# EAGLE design AS5600_Module (EAGLE 9.6.2)
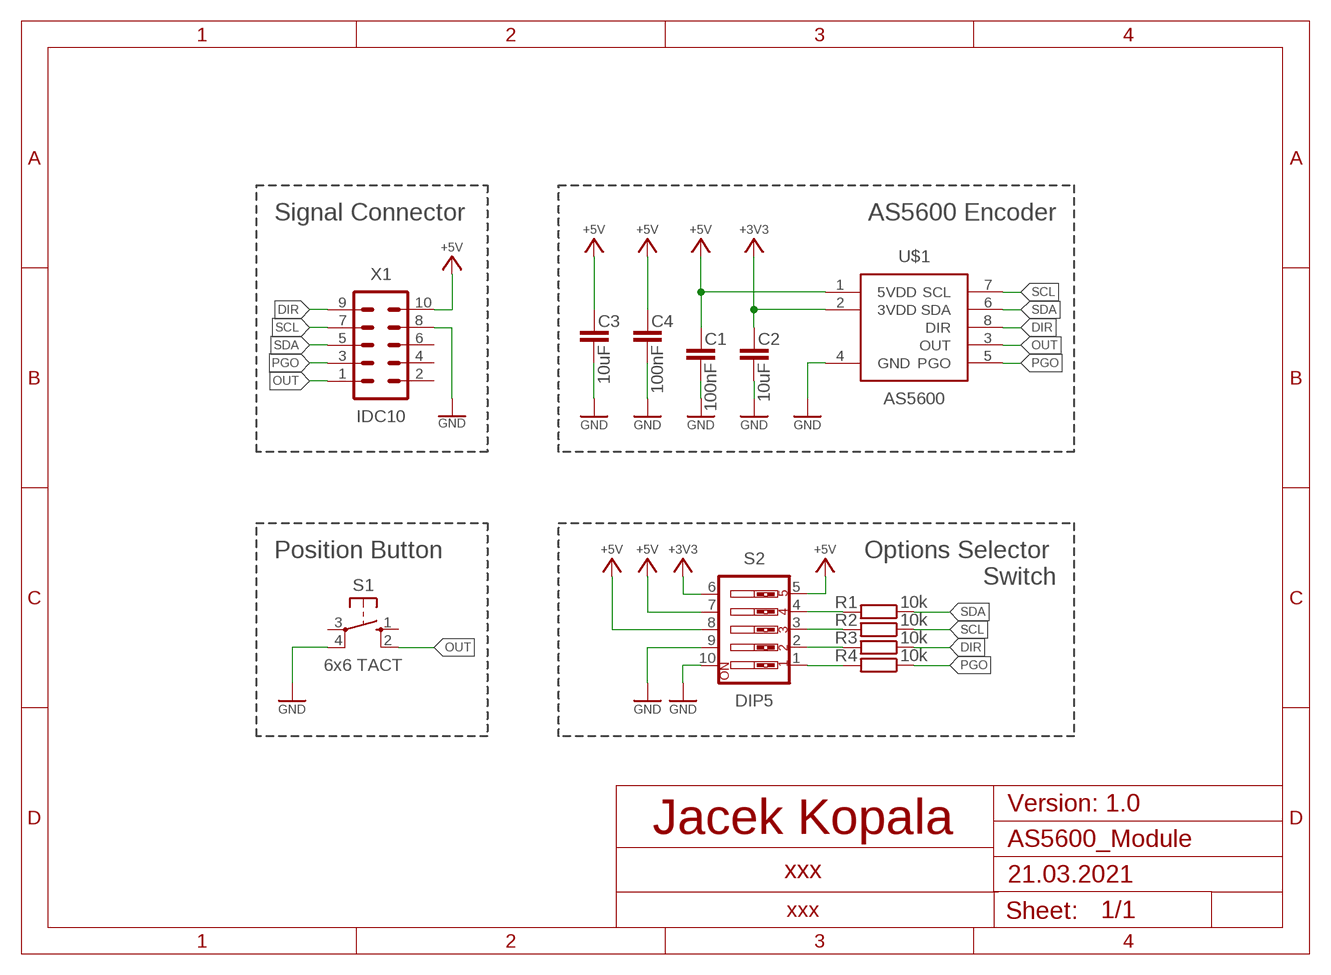
[diagram p0: schematic, sheet 1]

## Parts
C1  100nF  C-EUC0805K  [C0805K]
C2  10uF  C-EUC0805K  [C0805K]
C3  10uF  C-EUC0805K  [C0805K]
C4  100nF  C-EUC0805K  [C0805K]
R1  10k  R-EU_R0805  [R0805]
R2  10k  R-EU_R0805  [R0805]
R3  10k  R-EU_R0805  [R0805]
R4  10k  R-EU_R0805  [R0805]
S1  6x6 TACT  10-XX  [B3F-10XX]
S2  DIP5  SW_DIP-5  [EDG-05]
U$1  AS5600  [SO8]
X1  IDC10  ML10  [ML10]

## Nets
+3V3: C2.1 S2.6 U$1.2(3VDD)
+5V: C1.1 C3.1 C4.1 S2.5 S2.7 S2.8 U$1.1(5VDD) X1.10
DIR: R3.1 U$1.8(DIR) X1.9
GND: C1.2 C2.2 C3.2 C4.2 S1.4(P1) S2.9 S2.10 U$1.4(GND) X1.8
N$3: R3.2 S2.2
N$4: R2.2 S2.3
N$5: R1.2 S2.4
N$6: R4.2 S2.1
OUT: S1.2(S1) U$1.3(OUT) X1.1
PGO: R4.1 U$1.5(PGO) X1.3
SCL: R2.1 U$1.7(SCL) X1.7
SDA: R1.1 U$1.6(SDA) X1.5
Unconnected: S1.1(S) S1.3(P) X1.2 X1.4 X1.6

## Notes on the sheet
- Signal Connector | AS5600 Encoder
- Position Button
- Options Selector 
  Switch
- Jacek Kopala | Version: 1.0
- xxx
- 21.03.2021
- xxx

## Library data of the parts
C1-C4 = rcl:C-EU: CAPACITOR, European symbol; SPICEPREFIX: C
R1-R4 = rcl:R-EU_: RESISTOR, European symbol; SPICEPREFIX: R
S1 = switch-omron:10-XX: OMRON SWITCH; MPN: B3F-1000; OC_FARNELL: 176432; OC_NEWARK: 36M3542
S2 = special:SW_DIP-5: DIP SWITCH
U$1 = ams_jatsekku:AS5600
X1 = con-harting-ml:ML10: HARTING; OC_FARNELL: unknown; OC_NEWARK: unknown

## Board
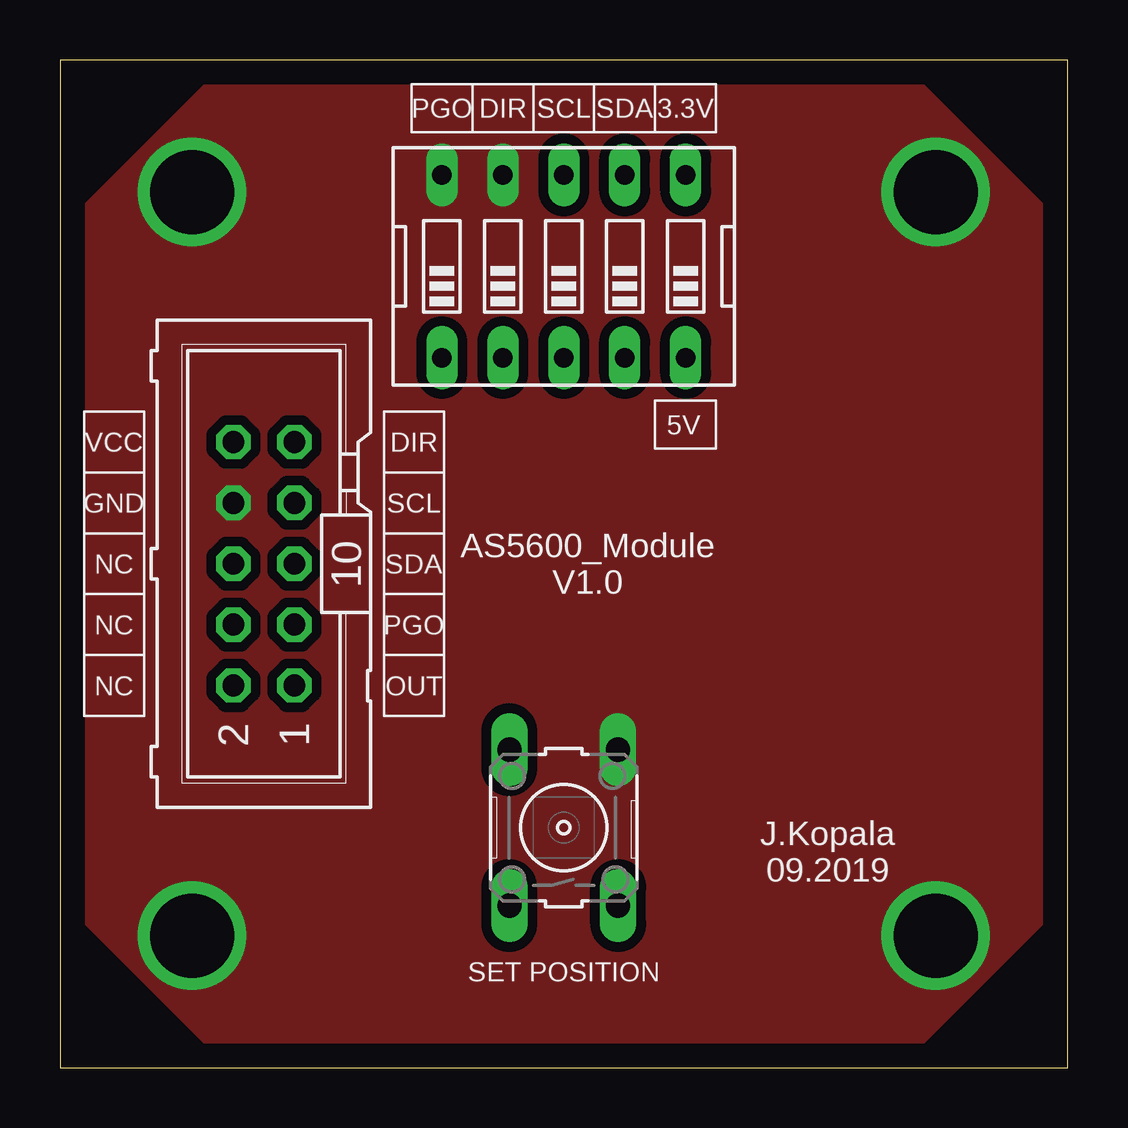
[diagram p1: board, top side]
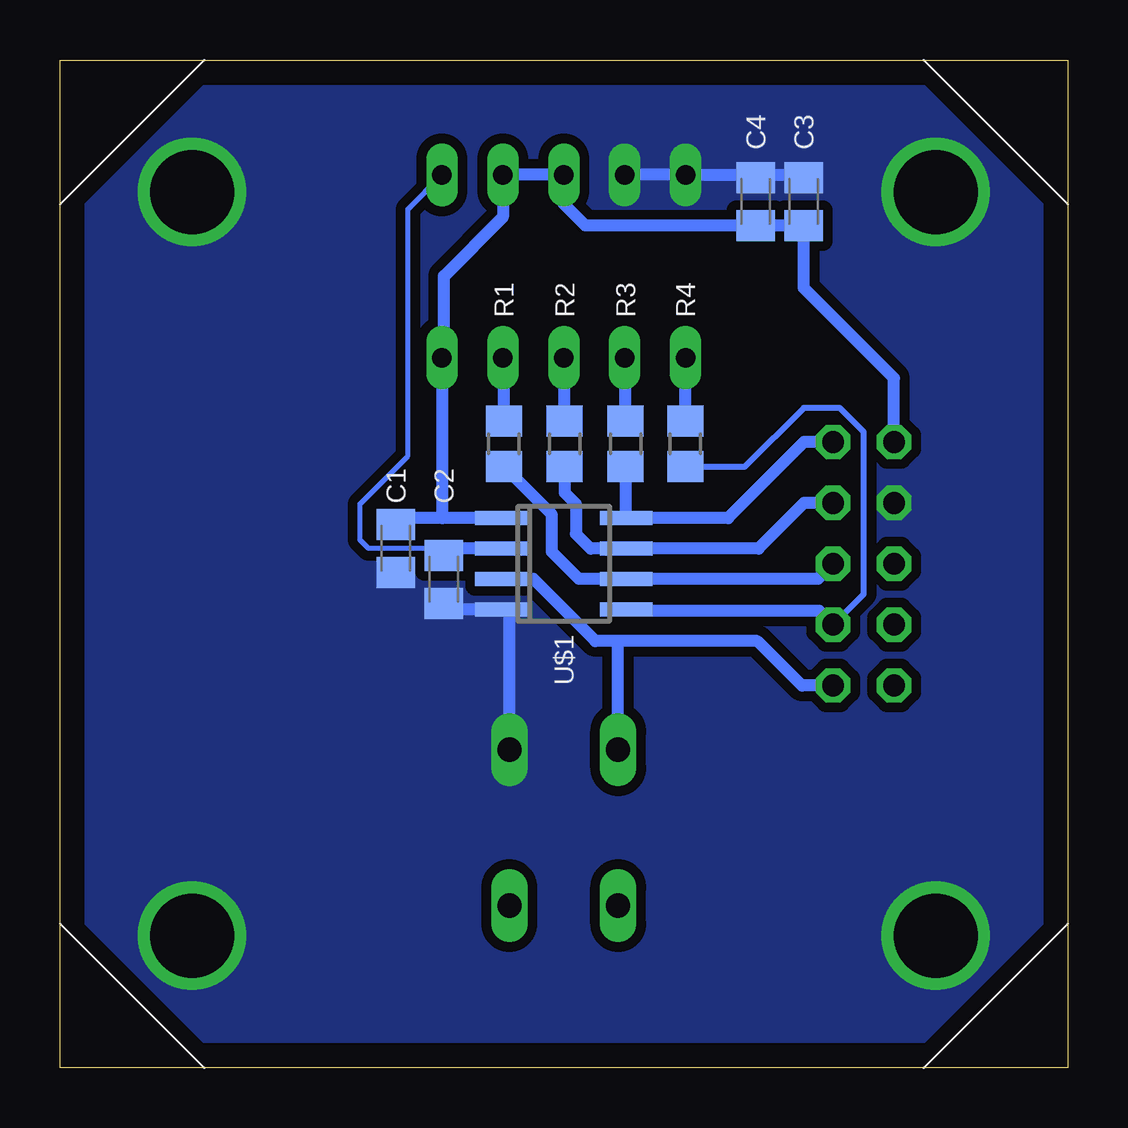
[diagram p2: board, bottom side, seen from below]

Size 42 x 42 mm. Coordinates in mm from the lower left corner, seen from the top.
Outline: 0,0 42,0 42,42 0,42 0,0
Copper layers (1*16): Top 0.035mm / dielectric 1.5mm / Bottom 0.035mm
Design rules "default": minimum track width 6mil, minimum drill 0.35mm, track to track 6mil, track to pad 6mil, pad to pad 6mil, via to via 6mil, smd to smd 6mil, copper to edge 40mil, drill to drill 6mil, minimum pad ring 10mil, minimum via ring 8mil, stop-mask expansion 4mil, vias tented up to drill 0mil, thermal gap 10mil

### Footprints (pad centres in the part's own frame; a part is rotated, then mirrored left to right if it is on the bottom)
C0805K = smd 1.3 x 1.6: 1 -1,0; 2 1,0
R0805 = smd 1.3 x 1.5: 1 -0.95,0; 2 0.95,0
B3F-10XX = drill 1.016 long: 1 -3.251,2.261; 2 3.251,2.261; 3 -3.251,-2.261; 4 3.251,-2.261
EDG-05 = drill 0.813 long: 1 -5.08,-3.81; 2 -2.54,-3.81; 3 0,-3.81; 4 2.54,-3.81; 5 5.08,-3.81; 6 5.08,3.81; 7 2.54,3.81; 8 0,3.81; 9 -2.54,3.81; 10 -5.08,3.81
SO8 = smd 0.6 x 2.2: 1 -1.905,-2.6; 2 -0.635,-2.6; 3 0.635,-2.6; 4 1.905,-2.6; 5 1.905,2.6; 6 0.635,2.6; 7 -0.635,2.6; 8 -1.905,2.6
ML10 = drill 0.914 octagon: 1 -5.08,-1.27; 2 -5.08,1.27; 3 -2.54,-1.27; 4 -2.54,1.27; 5 0,-1.27; 6 0,1.27; 7 2.54,-1.27; 8 2.54,1.27; 9 5.08,-1.27; 10 5.08,1.27

### Placement (x,y rotation side)
C1  28,21.64 270 bottom
C2  26,20.35 270 bottom
C3  11,36.1 90 bottom
C4  13,36.1 90 bottom
R1  23.5,26 90 bottom
R2  20.96,26 90 bottom
R3  18.43,26 90 bottom
R4  15.93,26 90 bottom
S1  21,10 90 top
S2  21,33.4 0 top
U$1  21,21 270 bottom
X1  8.5,21 90 top

### Tracks (layer width: path | path; a pad name or v marks a point on that pad's centre or on a via)
+3V3
  Bottom 0.2: C2.1 26,21.64 29.14,21.64 29.5,22 29.5,23.5 27.5,25.5 27.5,35.79 S2.6
  Bottom 0.254: C2.1 26.22,21.57
  Bottom 0.508: C2.1 26,21.64 U$1.2
+5V
  Bottom 0.508: 27.89,22.64 C1.1 27.73,22.91 26.07,22.91 | U$1.1 26.07,22.91 | 26.07,22.91 26.08,22.91 S2.5 26,29.67 26,33 23.54,35.46 S2.7 S2.8 21,36 20.1,35.1 C4.1 C3.1 11,32.5 7.23,28.73 X1.10
DIR
  Bottom 0.508: X1.9 10.98,26.08 14.15,22.91 U$1.8 18.43,22.93 R3.1
GND  (via drill 3.5)
  Bottom 0.508: S1.4 23.26,19.04 23.32,19.09 U$1.4 25.75,19.09 C2.2 | S2.9 S2.10 11.11,37.21 C3.2
  other vias: 5.5,36.5 5.5,5.5 36.5,36.5 36.5,5.5
  pour Bottom (isolate 0.406, no thermals): 1,6 6,1 36,1 41,6 41,36 36,41 6,41 1,36
  pour Top (isolate 0.406, no thermals): 6,41 1,36 1,6 6,1 36,1 41,6 41,36 36,41
N$3
  Bottom 0.508: R3.2 18.43,29.56 S2.2
N$4
  Bottom 0.508: R2.2 20.96,29.55 S2.3
N$5
  Bottom 0.508: R1.2 23.5,29.55 S2.4
N$6
  Bottom 0.508: R4.2 S2.1
OUT
  Bottom 0.508: U$1.3 22.27,20.36 19.68,17.78 18.74,17.78 | X1.1 11.07,15.92 12.93,17.78 18.74,17.78 | S1.2 18.74,17.78
PGO
  Bottom 0.254: X1.3 8.5,19.73 8.5,26.5 9.5,27.5 11,27.5 13.45,25.05 R4.1
  Bottom 0.508: U$1.5 18.36,19.05 10.36,19.05 X1.3
SCL
  Bottom 0.508: X1.7 10.98,23.54 12.88,21.64 U$1.7 19.89,21.64 20.5,22.25 20.5,23.5 20.96,23.96 R2.1
SDA
  Bottom 0.508: X1.5 10.4,20.36 U$1.6 20.36,20.36 21.5,21.5 21.5,23.05 R1.1

### Text on the board
tPlace: PGO | DIR | SCL | SDA | 3.3V | 5V | VCC | DIR | GND | SCL | NC | SDA | AS5600_Module / V1.0 | NC | PGO | NC | OUT | J.Kopala / 09.2019 | SET POSITION